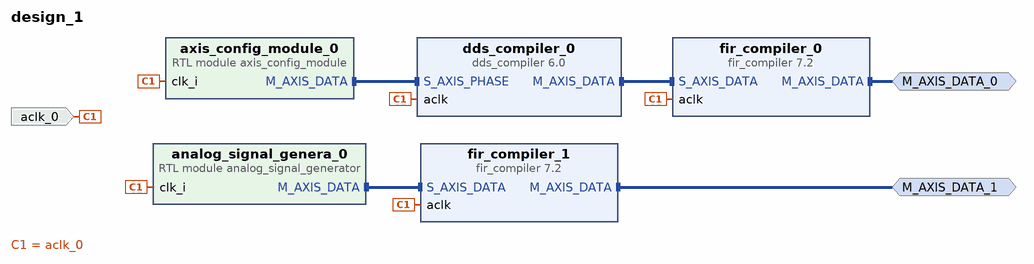
[diagram p0: block diagram of the top level]
# Vivado block design design_1, xc7a35tcpg236-1, Vivado 2024.1.2
create_bd_design design_1

create_bd_intf_port -mode Master -vlnv xilinx.com:interface:axis_rtl:1.0 M_AXIS_DATA_0
create_bd_intf_port -mode Master -vlnv xilinx.com:interface:axis_rtl:1.0 M_AXIS_DATA_1
create_bd_port -dir I -type clk aclk_0
set_property -dict {CONFIG.ASSOCIATED_BUSIF M_AXIS_DATA_0:M_AXIS_DATA_1} [get_bd_ports aclk_0]

create_bd_cell -type ip -vlnv xilinx.com:ip:dds_compiler:6.0 dds_compiler_0
set_property -dict [list \
  CONFIG.DATA_Has_TLAST Not_Required \
  CONFIG.Frequency_Resolution 0.02328306437 \
  CONFIG.Has_TREADY false \
  CONFIG.Latency 3 \
  CONFIG.Negative_Sine false \
  CONFIG.Noise_Shaping Auto \
  CONFIG.OUTPUT_FORM Twos_Complement \
  CONFIG.Output_Frequency1 0 \
  CONFIG.Output_Selection Sine \
  CONFIG.Output_Width 8 \
  CONFIG.PINC1 0 \
  CONFIG.Parameter_Entry System_Parameters \
  CONFIG.Phase_Increment Streaming \
  CONFIG.Phase_Width 32 \
  CONFIG.Resync false \
  CONFIG.S_PHASE_Has_TUSER Not_Required \
] [get_bd_cells dds_compiler_0]
create_bd_cell -type module -reference axis_config_module axis_config_module_0
create_bd_cell -type ip -vlnv xilinx.com:ip:fir_compiler:7.2 fir_compiler_0
set_property -dict [list \
  CONFIG.Clock_Frequency 100.0 \
  CONFIG.CoefficientSource COE_File \
  CONFIG.Coefficient_File ../../../../../../../../Matlab_Project/Digital_Filter/coeff_bpf.coe \
  CONFIG.Coefficient_Fractional_Bits 0 \
  CONFIG.Coefficient_Sets 1 \
  CONFIG.Coefficient_Sign Signed \
  CONFIG.Coefficient_Structure Inferred \
  CONFIG.Coefficient_Width 16 \
  CONFIG.ColumnConfig 10 \
  CONFIG.DATA_Has_TLAST Not_Required \
  CONFIG.Filter_Architecture Systolic_Multiply_Accumulate \
  CONFIG.M_DATA_Has_TUSER Not_Required \
  CONFIG.Number_Channels 1 \
  CONFIG.Output_Width 28 \
  CONFIG.Quantization Integer_Coefficients \
  CONFIG.S_DATA_Has_TUSER Not_Required \
  CONFIG.Sample_Frequency 10 \
  CONFIG.Select_Pattern All \
] [get_bd_cells fir_compiler_0]
create_bd_cell -type module -reference analog_signal_generator analog_signal_genera_0
create_bd_cell -type ip -vlnv xilinx.com:ip:fir_compiler:7.2 fir_compiler_1
set_property -dict [list \
  CONFIG.Clock_Frequency 100.0 \
  CONFIG.CoefficientSource COE_File \
  CONFIG.Coefficient_File ../../../../../../../../Matlab_Project/Digital_Filter/coeff_bpf.coe \
  CONFIG.Coefficient_Fractional_Bits 0 \
  CONFIG.Coefficient_Sets 1 \
  CONFIG.Coefficient_Sign Signed \
  CONFIG.Coefficient_Structure Inferred \
  CONFIG.Coefficient_Width 32 \
  CONFIG.ColumnConfig 10 \
  CONFIG.DATA_Has_TLAST Not_Required \
  CONFIG.Data_Fractional_Bits 16 \
  CONFIG.Data_Width 16 \
  CONFIG.Filter_Architecture Systolic_Multiply_Accumulate \
  CONFIG.M_DATA_Has_TUSER Not_Required \
  CONFIG.Number_Channels 1 \
  CONFIG.Output_Rounding_Mode Full_Precision \
  CONFIG.Output_Width 36 \
  CONFIG.Quantization Integer_Coefficients \
  CONFIG.S_DATA_Has_TUSER Not_Required \
  CONFIG.Sample_Frequency 10 \
  CONFIG.Select_Pattern All \
] [get_bd_cells fir_compiler_1]

# ---- connections ----

connect_bd_intf_net [get_bd_intf_pins analog_signal_genera_0/M_AXIS_DATA] [get_bd_intf_pins fir_compiler_1/S_AXIS_DATA]
connect_bd_intf_net [get_bd_intf_pins axis_config_module_0/M_AXIS_DATA] [get_bd_intf_pins dds_compiler_0/S_AXIS_PHASE]
connect_bd_intf_net [get_bd_intf_pins fir_compiler_0/S_AXIS_DATA] [get_bd_intf_pins dds_compiler_0/M_AXIS_DATA]
connect_bd_intf_net [get_bd_intf_ports M_AXIS_DATA_0] [get_bd_intf_pins fir_compiler_0/M_AXIS_DATA]
connect_bd_intf_net [get_bd_intf_ports M_AXIS_DATA_1] [get_bd_intf_pins fir_compiler_1/M_AXIS_DATA]
connect_bd_net -net aclk_0_1 [get_bd_ports aclk_0] \
  [get_bd_pins dds_compiler_0/aclk] [get_bd_pins fir_compiler_0/aclk] [get_bd_pins fir_compiler_1/aclk] \
  [get_bd_pins axis_config_module_0/clk_i] [get_bd_pins analog_signal_genera_0/clk_i]

validate_bd_design
save_bd_design
